# EAGLE design DSC_IO_Board (EAGLE 7.5.0)
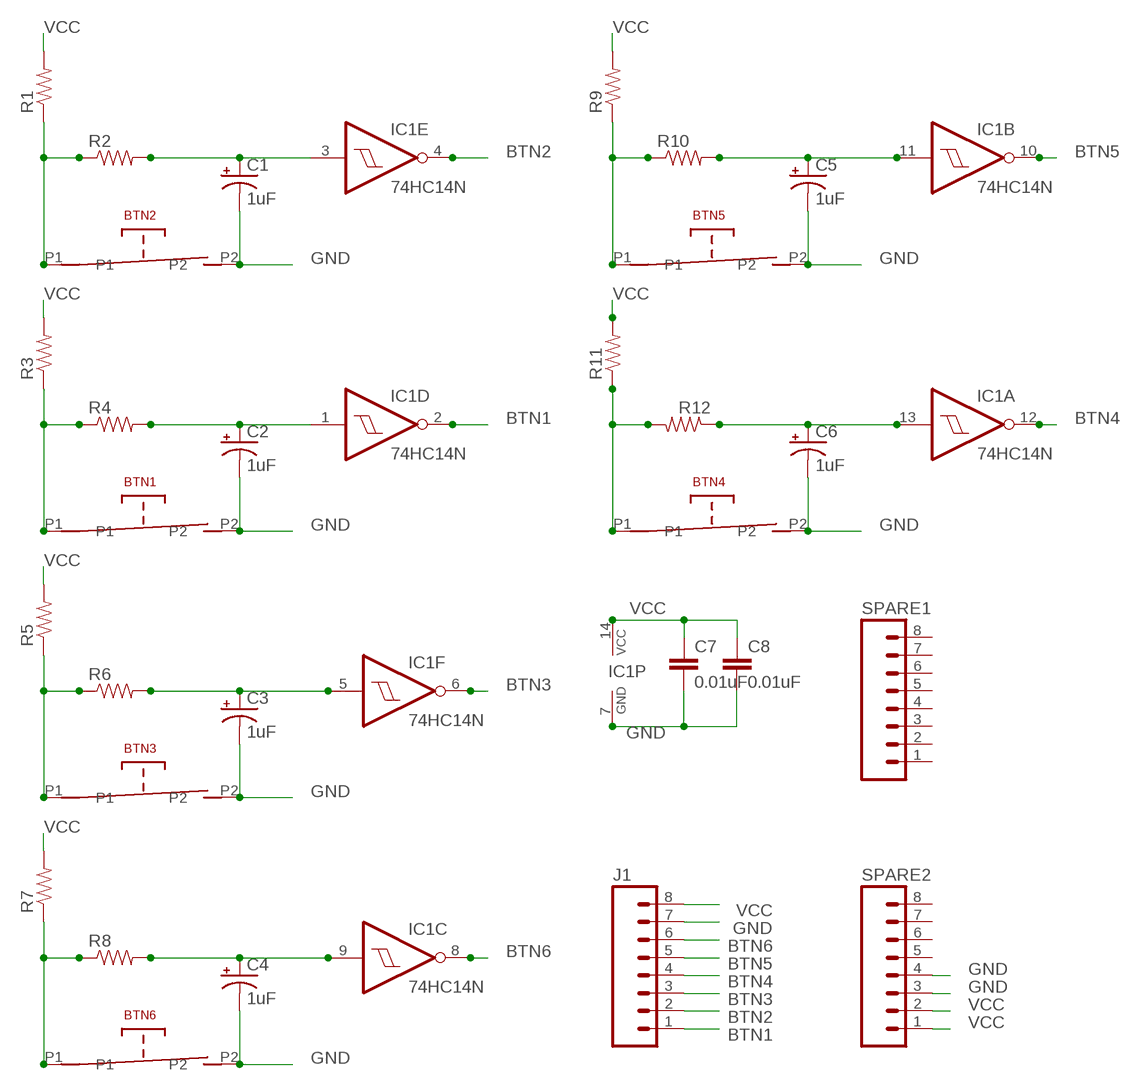
[diagram p0: schematic, sheet 1]

## Parts
BTN1  MOMENTARY-TACTILE-SWTICH  [MOMENTARY-TACTILE-SWITCH]
BTN2  MOMENTARY-TACTILE-SWTICH  [MOMENTARY-TACTILE-SWITCH]
BTN3  MOMENTARY-TACTILE-SWTICH  [MOMENTARY-TACTILE-SWITCH]
BTN4  MOMENTARY-TACTILE-SWTICH  [MOMENTARY-TACTILE-SWITCH]
BTN5  MOMENTARY-TACTILE-SWTICH  [MOMENTARY-TACTILE-SWITCH]
BTN6  MOMENTARY-TACTILE-SWTICH  [MOMENTARY-TACTILE-SWITCH]
C1  1uF  10UF-25V-20%(PTH)KIT  [CPOL-RADIAL-10UF-25V-KIT]
C2  1uF  10UF-25V-20%(PTH)KIT  [CPOL-RADIAL-10UF-25V-KIT]
C3  1uF  10UF-25V-20%(PTH)KIT  [CPOL-RADIAL-10UF-25V-KIT]
C4  1uF  10UF-25V-20%(PTH)KIT  [CPOL-RADIAL-10UF-25V-KIT]
C5  1uF  10UF-25V-20%(PTH)KIT  [CPOL-RADIAL-10UF-25V-KIT]
C6  1uF  10UF-25V-20%(PTH)KIT  [CPOL-RADIAL-10UF-25V-KIT]
C7  0.01uF  CAPPTH  [CAP-PTH-SMALL]
C8  0.01uF  CAPPTH  [CAP-PTH-SMALL]
IC1  74HC14N  [DIL14]
J1  M08  [1X08_ROUND]
R1  1KOHM-1/4W-1%(PTH)  [AXIAL-0.3]
R2  1KOHM-1/4W-1%(PTH)  [AXIAL-0.3]
R3  1KOHM-1/4W-1%(PTH)  [AXIAL-0.3]
R4  1KOHM-1/4W-1%(PTH)  [AXIAL-0.3]
R5  1KOHM-1/4W-1%(PTH)  [AXIAL-0.3]
R6  1KOHM-1/4W-1%(PTH)  [AXIAL-0.3]
R7  1KOHM-1/4W-1%(PTH)  [AXIAL-0.3]
R8  1KOHM-1/4W-1%(PTH)  [AXIAL-0.3]
R9  1KOHM-1/4W-1%(PTH)  [AXIAL-0.3]
R10  1KOHM-1/4W-1%(PTH)  [AXIAL-0.3]
R11  1KOHM-1/4W-1%(PTH)  [AXIAL-0.3]
R12  1KOHM-1/4W-1%(PTH)  [AXIAL-0.3]
SPARE1  M08  [1X08_ROUND]
SPARE2  M08  [1X08_ROUND]

## Nets
BTN1: IC1.2(D:O) J1.1
BTN2: IC1.4(E:O) J1.2
BTN3: IC1.6(F:O) J1.3
BTN4: IC1.12(A:O) J1.4
BTN5: IC1.10(B:O) J1.5
BTN6: IC1.8(C:O) J1.6
GND: BTN1.P2 BTN2.P2 BTN3.P2 BTN4.P2 BTN5.P2 BTN6.P2 C1.2(-) C2.2(-) C3.2(-) C4.2(-) C5.2(-) C6.2(-) C7.2 C8.2 IC1.7(P:GND) J1.7 SPARE2.3 SPARE2.4
N$1: BTN4.P1 R11.P$1 R12.P$2
N$2: BTN1.P1 R3.P$1 R4.P$1
N$3: BTN2.P1 R1.P$1 R2.P$1
N$4: C1.1(+) IC1.3(E:I) R2.P$2
N$5: C2.1(+) IC1.1(D:I) R4.P$2
N$6: BTN3.P1 R5.P$1 R6.P$1
N$7: C3.1(+) IC1.5(F:I) R6.P$2
N$8: BTN6.P1 R7.P$1 R8.P$1
N$9: C4.1(+) IC1.9(C:I) R8.P$2
N$10: BTN5.P1 R9.P$1 R10.P$1
N$11: C5.1(+) IC1.11(B:I) R10.P$2
N$12: C6.1(+) IC1.13(A:I) R12.P$1
VCC: C7.1 C8.1 IC1.14(P:VCC) J1.8 R1.P$2 R3.P$2 R5.P$2 R7.P$2 R9.P$2 R11.P$2 SPARE2.1 SPARE2.2
Unconnected: SPARE1.1 SPARE1.2 SPARE1.3 SPARE1.4 SPARE1.5 SPARE1.6 SPARE1.7 SPARE1.8 SPARE2.5 SPARE2.6 SPARE2.7 SPARE2.8

## Library data of the parts
BTN1-BTN6 = switch-tact:MOMENTARY-TACTILE-SWTICH
C1-C6 = SparkFun-Capacitors:10UF-25V-20%(PTH): CAP-08440; PROD_ID: CAP-08440
C7 C8 = SparkFun-Capacitors:CAP: Capacitor Standard 0603 ceramic capacitor, and 0.1" leaded capacitor.
IC1 = 74xx-eu:74*14: Hex schmitt trigger INVERTER
J1 SPARE1 SPARE2 = SparkFun-Connectors:M08: Header 8 Standard 8-pin 0.1" header. Use with straight break away headers (SKU : PRT-00116), right angle break away headers (PRT-00553), swiss pins (PRT-00743), machine pins (PRT-00117), and female headers (PRT-00115).; PROD_ID: CONN-08437
R1-R12 = SparkFun-Resistors:1KOHM-1/4W-1%(PTH): RES-12182; PROD_ID: RES-12182; VALUE: 1K

## Board
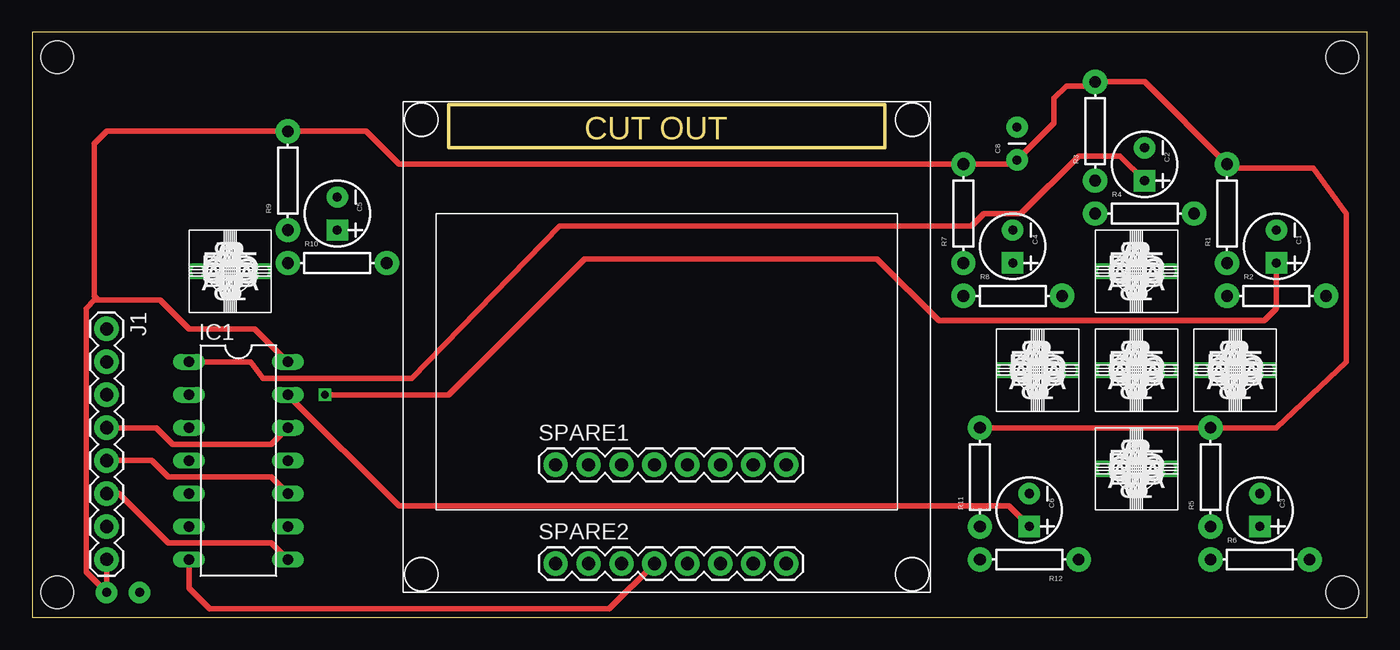
[diagram p1: board, top side]
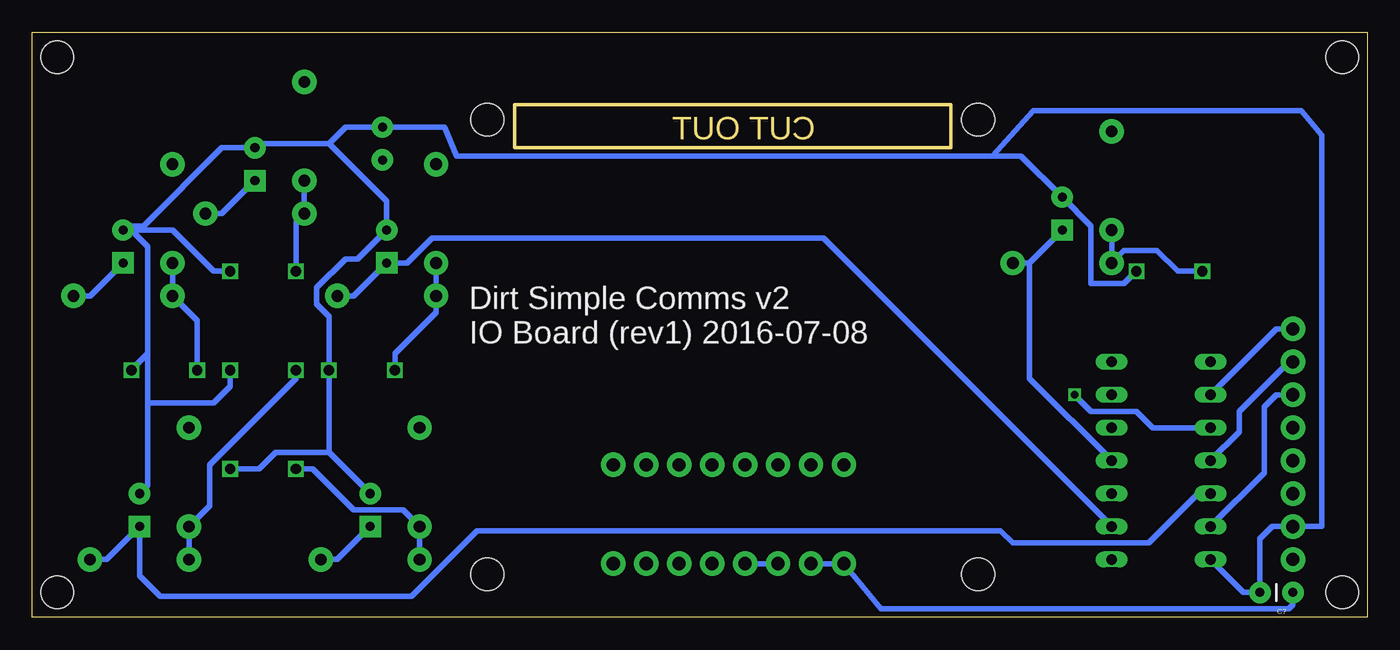
[diagram p2: board, bottom side, seen from below]

Size 102.87 x 45.09 mm. Coordinates in mm from the lower left corner, seen from the top.
Outline: 0,0 102.87,0 102.87,45.09 0,45.09 0,0
Outline: 65.72,39.5 32.07,39.5 32.07,36.2 65.72,36.2 65.72,39.5
Copper layers (1*16): Top 0.0356mm / dielectric 1.5011mm / Bottom 0.0356mm
Design rules "oshpark-2layer": minimum track width 6mil, minimum drill 13mil, track to track 6mil, track to pad 6mil, pad to pad 6mil, via to via 6mil, smd to smd 6mil, copper to edge 15mil, drill to drill 6mil, minimum pad ring 7mil, minimum via ring 7mil, stop-mask expansion 2.5mil, vias tented up to drill 0mil, thermal gap 10mil
Holes 2.54 mm at 29.97,38.35 67.82,38.35 29.97,3.3 67.82,3.3 1.91,43.18 1.91,1.91 100.97,1.91 100.97,43.18

### Footprints (pad centres in the part's own frame; a part is rotated, then mirrored left to right if it is on the bottom)
MOMENTARY-TACTILE-SWITCH = drill 0.8 square: P1 0.635,3.175; P2 5.715,3.175
CPOL-RADIAL-10UF-25V-KIT = drill 0.7 pad 1.651 square: 1 1.27,0 | drill 0.7 pad 1.651: 2 -1.27,0
CAP-PTH-SMALL = drill 0.7 pad 1.651: 1 0,0; 2 2.54,0
DIL14 = drill 0.813 long: 1 -7.62,-3.81; 2 -5.08,-3.81; 3 -2.54,-3.81; 4 0,-3.81; 5 2.54,-3.81; 6 5.08,-3.81; 7 7.62,-3.81; 8 7.62,3.81; 9 5.08,3.81; 10 2.54,3.81; 11 0,3.81; 12 -2.54,3.81; 13 -5.08,3.81; 14 -7.62,3.81
1X08_ROUND = drill 1.016 pad 1.88: 1 0,0; 2 2.54,0; 3 5.08,0; 4 7.62,0; 5 10.16,0; 6 12.7,0; 7 15.24,0; 8 17.78,0
AXIAL-0.3 = drill 0.9 pad 1.88: P$1 -3.81,0; P$2 3.81,0

### Placement (x,y rotation side)
BTN1  81.92,23.5 0 top
BTN2  89.54,15.88 0 top
BTN3  81.92,15.88 0 top
BTN4  81.92,8.26 0 top
BTN5  12.06,23.5 0 top
BTN6  74.3,15.88 0 top
C1  95.89,28.58 270 top
C2  85.73,34.92 270 top
C3  94.62,8.26 270 top
C4  75.57,28.58 270 top
C5  23.5,31.12 270 top
C6  76.84,8.26 270 top
C7  5.71,1.91 180 bottom
C8  75.88,35.24 90 top
IC1  15.88,12.06 270 top
J1  5.71,22.23 270 top
R1  92.08,31.12 90 top
R2  95.89,24.77 0 top
R3  81.92,37.46 90 top
R4  85.73,31.12 0 top
R5  90.81,10.79 90 top
R6  94.62,4.45 0 top
R7  71.76,31.12 90 top
R8  75.57,24.77 0 top
R9  19.69,33.66 90 top
R10  23.5,27.31 0 top
R11  73.03,10.79 90 top
R12  76.84,4.45 180 top
SPARE1  40.32,11.75 0 top
SPARE2  40.32,4.13 0 top
U$1  [OLED-DISPLAY]  28.58,1.91 0 top

### Tracks (layer width: path | path; a pad name or v marks a point on that pad's centre or on a via)
BTN1
  Bottom 0.406: J1.1 6.98,22.23 IC1.2
BTN2
  Bottom 0.406: J1.2 6.03,19.69 9.84,15.88 9.84,14.29 IC1.4
BTN3
  Bottom 0.406: J1.3 6.98,17.15 7.94,16.19 7.94,11.11 IC1.6
BTN4
  Top 0.406: J1.4 9.53,14.61 10.79,13.33 18.42,13.33 IC1.12
BTN5
  Top 0.406: J1.5 9.21,12.06 10.48,10.79 18.42,10.79 IC1.10
BTN6
  Top 0.406: J1.6 6.67,9.53 10.48,5.71 18.42,5.71 IC1.8
GND
  Top 0.406: SPARE2.4 44.45,0.64 13.65,0.64 12.06,2.22 IC1.7
  Bottom 0.406: C1.2 95.25,29.85 93.98,28.58 93.98,20.32 | 93.98,20.32 BTN2.P2 | 93.98,20.32 93.98,16.51 | 93.98,16.51 93.98,10.16 C3.2 | C2.2 86.36,36.2 | 86.36,36.2 88.27,36.2 94.3,30.16 95.57,30.16 C1.2 | 80.01,36.51 75.57,32.07 C4.2 77.79,27.62 78.74,27.62 80.96,25.4 80.96,24.13 80.01,23.18 BTN6.P2 80.01,12.7 | 80.01,36.51 86.04,36.51 86.36,36.2 | BTN1.P2 88.9,26.67 92.08,29.85 C1.2 | BTN5.P2 18.73,25.72 21.27,25.72 21.27,30.16 C5.2 26.67,35.56 28.89,35.56 | BTN4.P2 85.41,11.43 84.14,12.7 80.01,12.7 | 80.01,12.7 C6.2 | 28.89,35.56 25.72,39.05 5.08,39.05 3.49,37.15 3.49,6.98 J1.7 7.3,6.98 8.26,6.03 C7.2 9.53,1.91 IC1.7 | 28.89,35.56 70.17,35.56 71.12,37.78 C8.2 78.74,37.78 80.01,36.51 | BTN3.P2 87.63,17.78 88.9,16.51 93.98,16.51 | SPARE2.4 SPARE2.3
N$1
  Bottom 0.406: R12.P$2 R11.P$1 74.3,8.26 78.11,8.26 81.28,11.43 BTN4.P1
N$2
  Bottom 0.406: R3.P$1 R4.P$1 82.55,30.48 BTN1.P1
N$3
  Bottom 0.406: R1.P$1 R2.P$1 90.17,22.86 BTN2.P1
N$4  (via drill 0.6)
  Top 0.406: C1.1 95.89,23.81 94.93,22.86 69.85,22.86 65.09,27.62 42.54,27.62 32.07,17.15 v22.54,17.15
  Bottom 0.406: R2.P$2 98.43,24.77 C1.1 | IC1.3 16.51,14.61 17.78,15.88 21.27,15.88 v22.54,17.15
N$5
  Top 0.406: IC1.1 16.83,19.69 17.78,18.42 29.21,18.42 40.64,30.16 72.39,30.16 73.34,31.12 76.2,31.12 80.65,35.56 83.82,35.56 C2.1
  Bottom 0.406: R4.P$2 88.27,31.12 C2.1
N$6
  Bottom 0.406: R6.P$1 R5.P$1 89.22,8.57 89.22,11.75 82.55,18.42 BTN3.P1
N$7
  Bottom 0.406: R6.P$2 97.16,4.45 C3.1 94.62,3.17 93.03,1.59 73.66,1.59 68.58,6.67 28.26,6.67 27.31,5.71 16.83,5.71 13.02,9.53 IC1.5
N$8
  Bottom 0.406: R7.P$1 R8.P$1 71.76,23.5 74.93,20.32 BTN6.P1
N$9
  Bottom 0.406: R8.P$2 78.11,24.77 C4.1 73.98,27.31 72.07,29.21 41.91,29.21 IC1.9
N$10
  Bottom 0.406: R9.P$1 R10.P$1 18.73,28.26 16.19,28.26 14.61,26.67 BTN5.P1
N$11
  Bottom 0.406: R10.P$2 26.04,27.31 | 26.04,27.31 C5.1 | 26.04,27.31 26.04,18.42 IC1.11
N$12
  Top 0.406: IC1.13 28.26,8.57 75.25,8.57 C6.1
  Bottom 0.406: R12.P$1 79.38,4.45 C6.1
VCC
  Top 0.406: R11.P$2 R5.P$2 95.89,14.61 101.28,19.69 101.28,31.12 98.74,34.61 92.39,34.61 R1.P$2 85.73,41.27 R3.P$2 81.6,40.96 79.69,40.96 78.74,40 78.74,38.1 C8.1 75.57,34.92 R7.P$2 28.26,34.92 25.72,37.46 R9.P$2 5.71,37.46 4.76,36.51 4.76,24.77 5.08,24.45 | J1.8 C7.1 4.13,3.49 4.13,23.81 4.76,24.45 5.08,24.45 | 5.08,24.45 9.84,24.45 12.06,22.23 17.15,22.23 IC1.14
  Bottom 0.406: SPARE2.2 SPARE2.1 37.46,0.64 6.03,0.64 5.71,0.95 C7.1

### Text on the board
Dimension: CUT OUT
bPlace: Dirt Simple Comms v2 / IO Board (rev1) 2016-07-08